# Altium schematic sheet Services.SchDoc
size A0; Organization: Altium Limited; Address1: L3, 12a Rodborough Rd; Address2: Frenchs Forest; Address3: NSW; Address4: Australia 2086
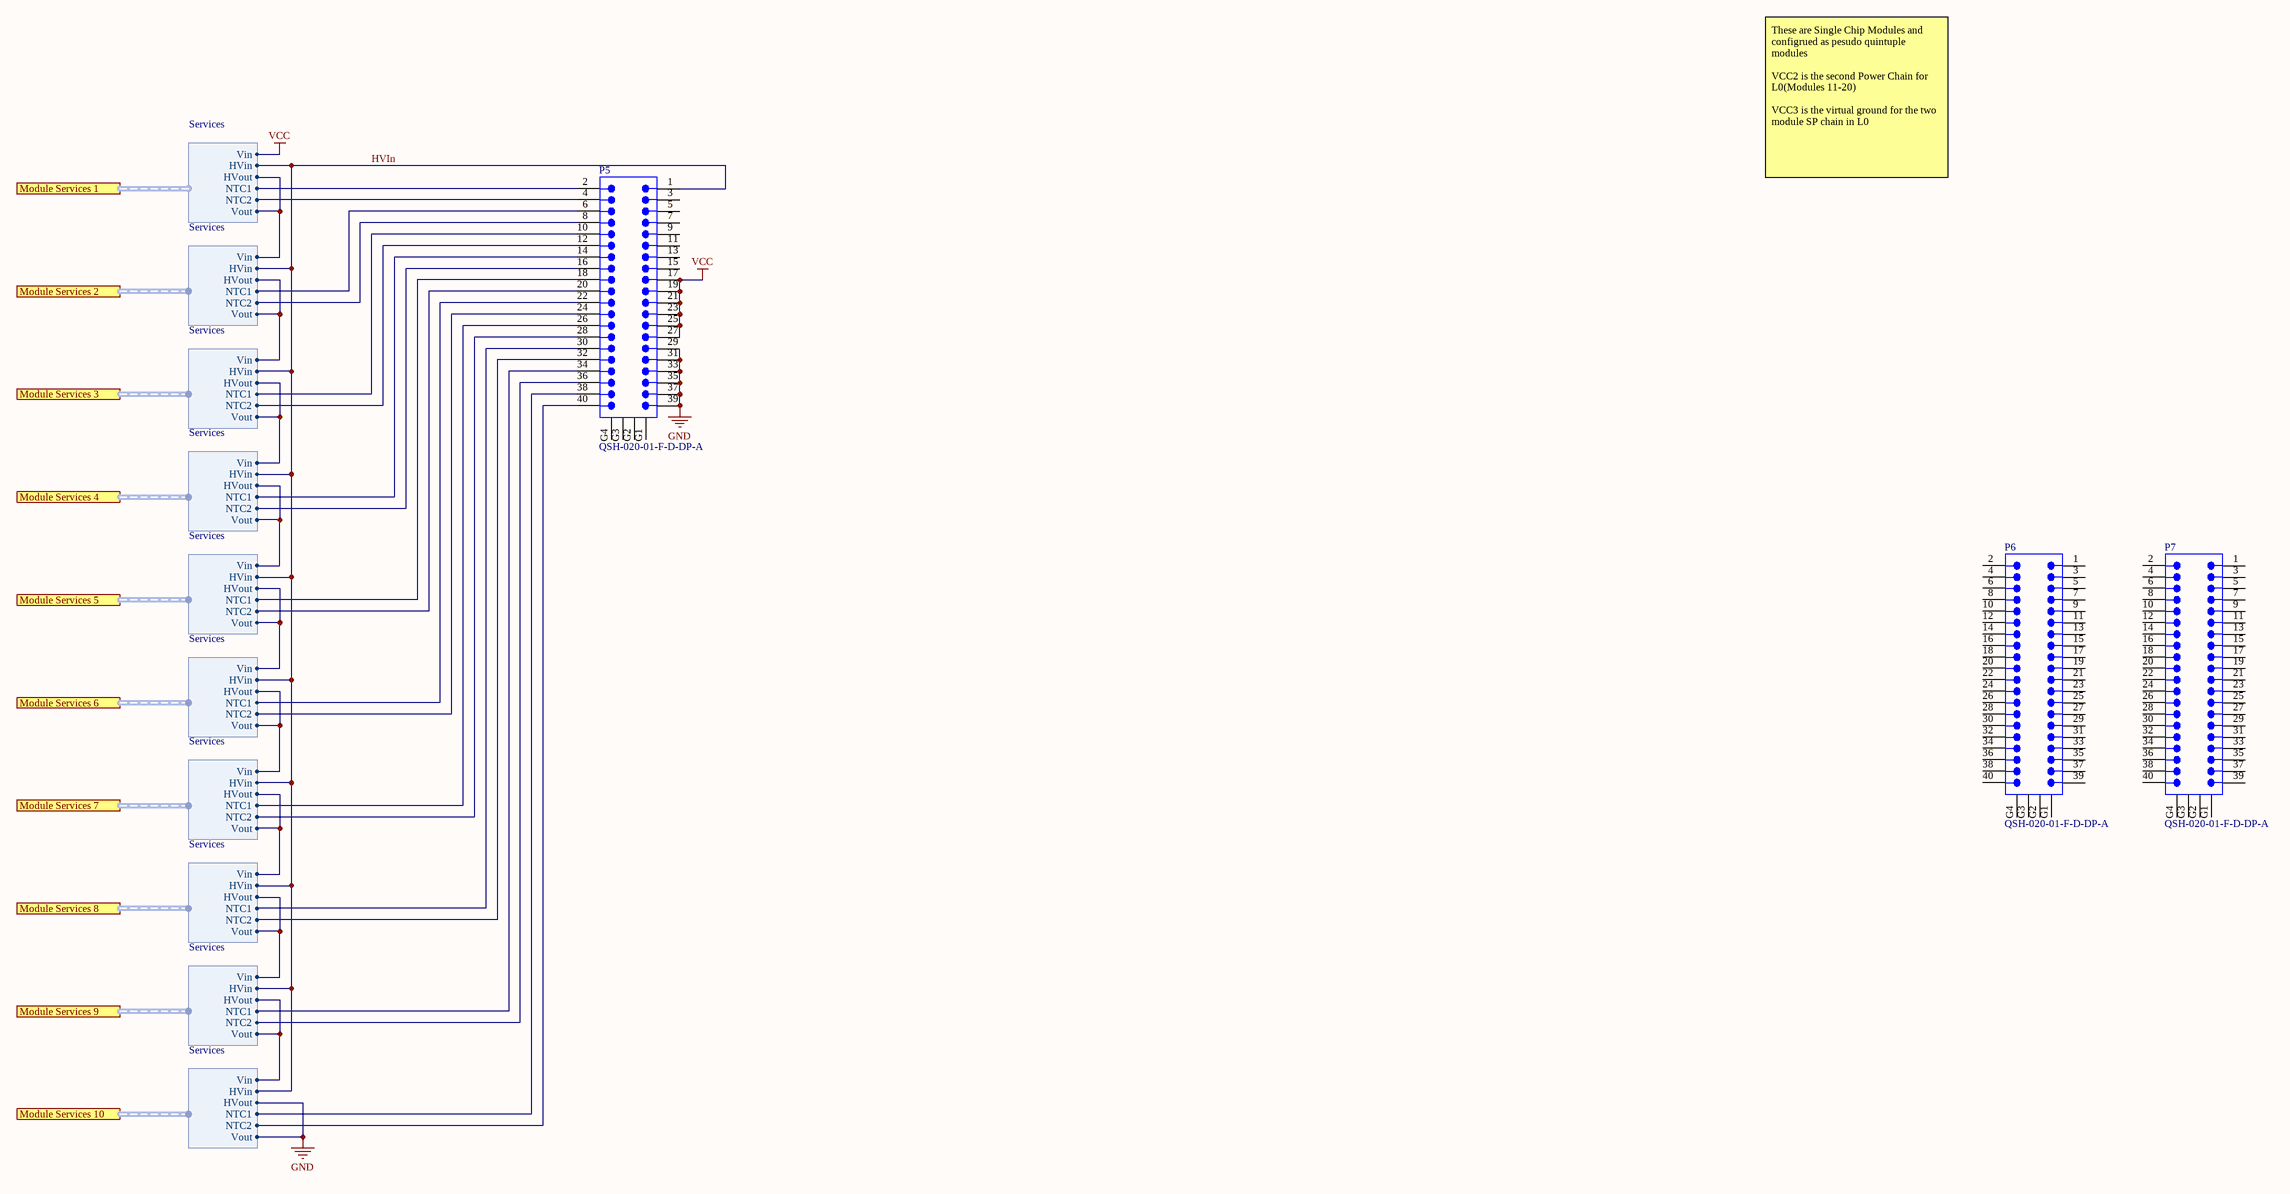
[diagram p0: Services.SchDoc]

## Parts
P5  QSH-020-01-F-D-DP-A  [QSH-020-01-X-D-DP-A]
P6  QSH-020-01-F-D-DP-A  [QSH-020-01-X-D-DP-A]
P7  QSH-020-01-F-D-DP-A  [QSH-020-01-X-D-DP-A]

## Ports
Module Services 1 (harness Services), Module Services 2 (harness Services), Module Services 3 (harness Services), Module Services 4 (harness Services), Module Services 5 (harness Services), Module Services 6 (harness Services), Module Services 7 (harness Services), Module Services 8 (harness Services), Module Services 9 (harness Services), Module Services 10 (harness Services)

## Harnesses
Services: Vin, Vout, HVin, HVout, NTC1, NTC2

## Nets
GND: P5.29 P5.31 P5.33 P5.35 P5.37 P5.39 ; port Module Services 10.Vout, port Module Services 10.HVout
VCC: P5.17 P5.19 P5.21 P5.23 P5.25 P5.27 ; port Module Services 1.Vin
HVIn: P5.1 ; port Module Services 1.HVin, port Module Services 2.HVin, port Module Services 3.HVin, port Module Services 4.HVin, port Module Services 5.HVin, port Module Services 6.HVin, port Module Services 7.HVin, port Module Services 8.HVin, port Module Services 9.HVin, port Module Services 10.HVin
NetP5_2: P5.2 ; port Module Services 1.NTC1
NetP5_4: P5.4 ; port Module Services 1.NTC2
NetP5_6: P5.6 ; port Module Services 2.NTC1
NetP5_8: P5.8 ; port Module Services 2.NTC2
NetP5_10: P5.10 ; port Module Services 3.NTC1
NetP5_12: P5.12 ; port Module Services 3.NTC2
NetP5_14: P5.14 ; port Module Services 4.NTC1
NetP5_16: P5.16 ; port Module Services 4.NTC2
NetP5_18: P5.18 ; port Module Services 5.NTC1
NetP5_20: P5.20 ; port Module Services 5.NTC2
NetP5_22: P5.22 ; port Module Services 6.NTC1
NetP5_24: P5.24 ; port Module Services 6.NTC2
NetP5_26: P5.26 ; port Module Services 7.NTC1
NetP5_28: P5.28 ; port Module Services 7.NTC2
NetP5_30: P5.30 ; port Module Services 8.NTC1
NetP5_32: P5.32 ; port Module Services 8.NTC2
NetP5_34: P5.34 ; port Module Services 9.NTC1
NetP5_36: P5.36 ; port Module Services 9.NTC2
NetP5_38: P5.38 ; port Module Services 10.NTC1
NetP5_40: P5.40 ; port Module Services 10.NTC2
(unnamed): port Module Services 1.Vout, port Module Services 1.HVout, port Module Services 2.Vin
(unnamed): port Module Services 2.Vout, port Module Services 2.HVout, port Module Services 3.Vin
(unnamed): port Module Services 3.Vout, port Module Services 3.HVout, port Module Services 4.Vin
(unnamed): port Module Services 4.Vout, port Module Services 4.HVout, port Module Services 5.Vin
(unnamed): port Module Services 5.Vout, port Module Services 5.HVout, port Module Services 6.Vin
(unnamed): port Module Services 6.Vout, port Module Services 6.HVout, port Module Services 7.Vin
(unnamed): port Module Services 7.Vout, port Module Services 7.HVout, port Module Services 8.Vin
(unnamed): port Module Services 8.Vout, port Module Services 8.HVout, port Module Services 9.Vin
(unnamed): port Module Services 9.Vout, port Module Services 9.HVout, port Module Services 10.Vin

Not connected (* = marked no-connect by the designer): P5 3 5 7 9 11 13 15 G1 G2 G3 G4; P6 1 2 3 4 5 6 7 8 9 10 11 12 13 14 15 16 17 18 19 20 21(20) 22(21) 23(21) 24(22) 25(22) 26(23) 27(23) 28(24) 29(24) 30(25) 31(25) 32(26) 33(26) 34(27) 35(27) 36(28) 37(28) 38(29) 39(29) 40(30) G1 G2 G3 G4; P7 1 2 3 4 5 6 7 8 9 10 11 12 13 14 15 16 17 18 19 20 21(20) 22(21) 23(21) 24(22) 25(22) 26(23) 27(23) 28(24) 29(24) 30(25) 31(25) 32(26) 33(26) 34(27) 35(27) 36(28) 37(28) 38(29) 39(29) 40(30) G1 G2 G3 G4

## Notes on the sheet
- These are Single Chip Modules and configrued as pesudo quintuple modules
  VCC2 is the second Power Chain for L0(Modules 11-20)
  VCC3 is the virtual ground for the two module SP chain in L0
- Title
- Size:
- Date:
- File:
- A0
- Number:
- Time:
- Revision:
- Sheet
- of

## Library data of the parts
P5-P7 = CN-2P-M-40: Board-to-Board Connector, Differnetial Pair, Vertical, 2-Row, Pitch 0.50mm, 40-Position, Male